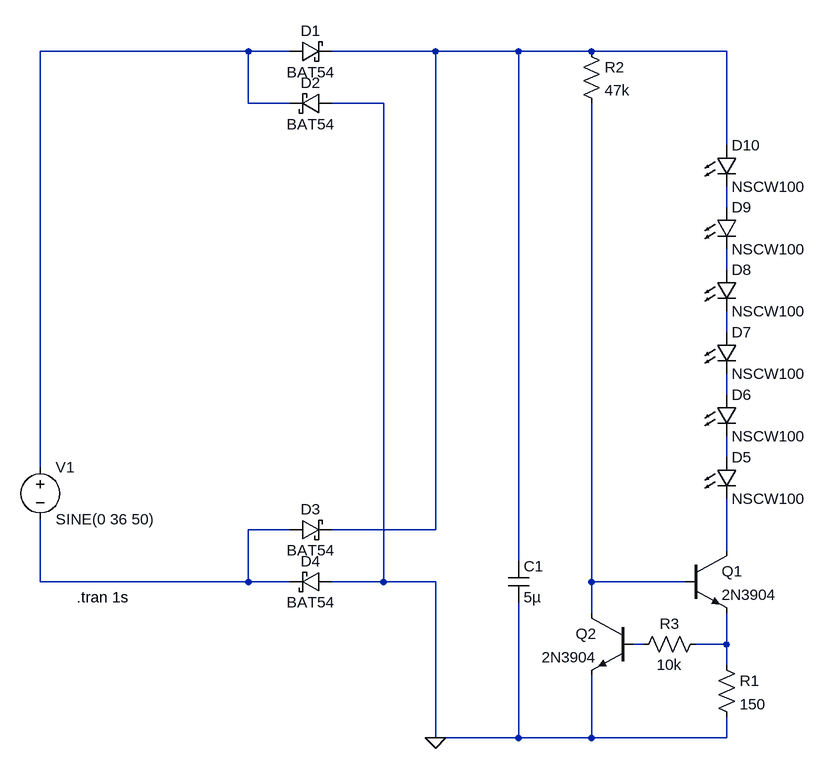
[diagram p0: schematic 3904.asc]
3904.asc, the LTspice schematic file:
Version 4
SHEET 1 880 680
WIRE -1072 -976 -1392 -976
WIRE -1008 -976 -1072 -976
WIRE -784 -976 -944 -976
WIRE -656 -976 -784 -976
WIRE -544 -976 -656 -976
WIRE -336 -976 -544 -976
WIRE -1072 -896 -1072 -976
WIRE -1008 -896 -1072 -896
WIRE -864 -896 -944 -896
WIRE -336 -832 -336 -976
WIRE -336 -736 -336 -768
WIRE -336 -640 -336 -672
WIRE -336 -544 -336 -576
WIRE -336 -448 -336 -480
WIRE -336 -352 -336 -384
WIRE -1392 -336 -1392 -976
WIRE -1008 -240 -1072 -240
WIRE -784 -240 -784 -976
WIRE -784 -240 -944 -240
WIRE -336 -208 -336 -288
WIRE -656 -192 -656 -976
WIRE -1392 -160 -1392 -256
WIRE -1072 -160 -1072 -240
WIRE -1072 -160 -1392 -160
WIRE -1008 -160 -1072 -160
WIRE -864 -160 -864 -896
WIRE -864 -160 -944 -160
WIRE -784 -160 -864 -160
WIRE -544 -160 -544 -896
WIRE -400 -160 -544 -160
WIRE -544 -112 -544 -160
WIRE -464 -64 -480 -64
WIRE -336 -64 -336 -112
WIRE -336 -64 -384 -64
WIRE -336 -32 -336 -64
WIRE -784 80 -784 -160
WIRE -656 80 -656 -128
WIRE -656 80 -784 80
WIRE -544 80 -544 -16
WIRE -544 80 -656 80
WIRE -336 80 -336 48
WIRE -336 80 -544 80
FLAG -784 80 0
SYMBOL voltage -1392 -352 R0
WINDOW 123 0 0 Left 0
WINDOW 39 0 0 Left 0
SYMATTR InstName V1
SYMATTR Value SINE(0 36 50)
SYMBOL schottky -1008 -960 R270
WINDOW 0 32 32 VTop 2
WINDOW 3 0 32 VBottom 2
SYMATTR InstName D1
SYMATTR Value BAT54
SYMATTR Description Diode
SYMATTR Type diode
SYMBOL schottky -944 -912 R90
WINDOW 0 0 32 VBottom 2
WINDOW 3 32 32 VTop 2
SYMATTR InstName D2
SYMATTR Value BAT54
SYMATTR Description Diode
SYMATTR Type diode
SYMBOL schottky -1008 -224 R270
WINDOW 0 32 32 VTop 2
WINDOW 3 0 32 VBottom 2
SYMATTR InstName D3
SYMATTR Value BAT54
SYMATTR Description Diode
SYMATTR Type diode
SYMBOL schottky -944 -176 R90
WINDOW 0 0 32 VBottom 2
WINDOW 3 32 32 VTop 2
SYMATTR InstName D4
SYMATTR Value BAT54
SYMATTR Description Diode
SYMATTR Type diode
SYMBOL LED -352 -352 R0
SYMATTR InstName D5
SYMATTR Value NSCW100
SYMATTR Description Diode
SYMATTR Type diode
SYMBOL cap -672 -192 R0
SYMATTR InstName C1
SYMATTR Value 5µ
SYMBOL npn -400 -208 R0
SYMATTR InstName Q1
SYMATTR Value 2N3904
SYMBOL res -352 -48 R0
SYMATTR InstName R1
SYMATTR Value 150
SYMBOL res -560 -992 R0
SYMATTR InstName R2
SYMATTR Value 47k
SYMBOL npn -480 -112 M0
SYMATTR InstName Q2
SYMATTR Value 2N3904
SYMBOL res -368 -80 R90
WINDOW 0 0 56 VBottom 2
WINDOW 3 32 56 VTop 2
SYMATTR InstName R3
SYMATTR Value 10k
SYMBOL LED -352 -448 R0
SYMATTR InstName D6
SYMATTR Value NSCW100
SYMATTR Description Diode
SYMATTR Type diode
SYMBOL LED -352 -544 R0
SYMATTR InstName D7
SYMATTR Value NSCW100
SYMATTR Description Diode
SYMATTR Type diode
SYMBOL LED -352 -640 R0
SYMATTR InstName D8
SYMATTR Value NSCW100
SYMATTR Description Diode
SYMATTR Type diode
SYMBOL LED -352 -736 R0
SYMATTR InstName D9
SYMATTR Value NSCW100
SYMATTR Description Diode
SYMATTR Type diode
SYMBOL LED -352 -832 R0
SYMATTR InstName D10
SYMATTR Value NSCW100
SYMATTR Description Diode
SYMATTR Type diode
TEXT -1336 -136 Left 2 !.tran 1s

The netlist it stands for:
* 3904.asc
V1 N001 N008 SINE(0 36 50)
D1 N001 N002 BAT54
D2 0 N001 BAT54
D3 N008 N002 BAT54
D4 0 N008 BAT54
D5 N007 N009 NSCW100
C1 N002 0 5µ
Q1 N009 N010 N012 0 2N3904
R1 N012 0 150
R2 N002 N010 47k
Q2 N010 N011 0 0 2N3904
R3 N012 N011 10k
D6 N006 N007 NSCW100
D7 N005 N006 NSCW100
D8 N004 N005 NSCW100
D9 N003 N004 NSCW100
D10 N002 N003 NSCW100
.model D D
.lib standard.dio
.model NPN NPN
.model PNP PNP
.lib standard.bjt
.tran 1s
.backanno
.end